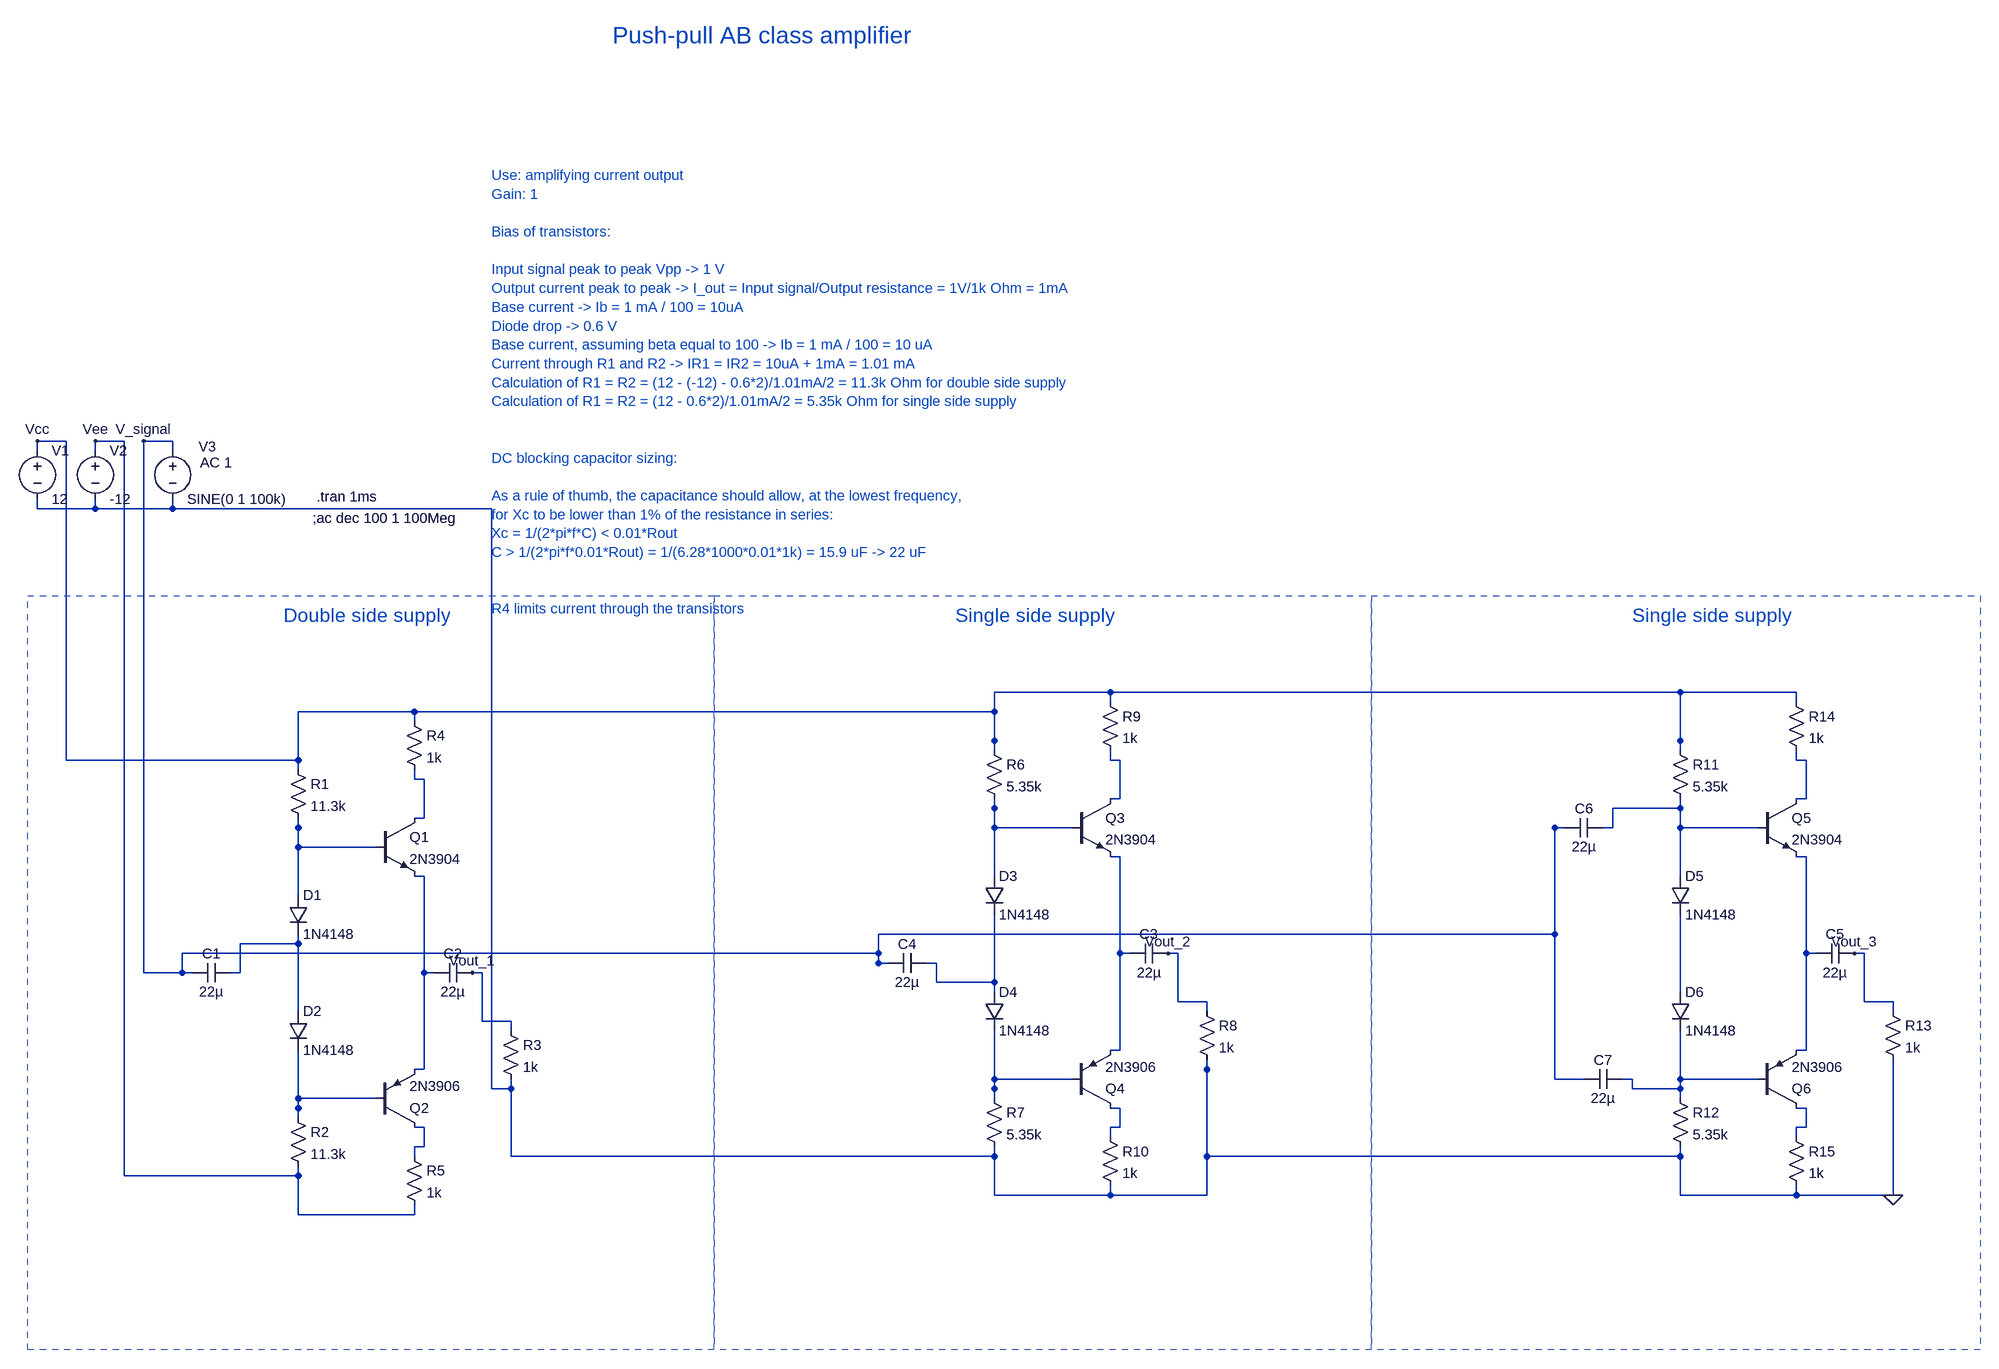
[diagram p0: schematic Push-pull-amplifier-AB-BJT.asc]
Push-pull-amplifier-AB-BJT.asc, the LTspice schematic file:
Version 4.1
SHEET 1 3188 900
WIRE 1424 624 1424 640
WIRE 2368 560 2368 576
WIRE 2720 416 2720 432
WIRE 2560 624 2560 640
WIRE 432 448 432 464
WIRE 1232 560 1232 576
WIRE 1584 416 1584 432
WIRE -352 -512 -352 -496
WIRE -256 -512 -256 -496
WIRE -128 -512 -128 -496
WIRE 1424 640 1232 640
WIRE 1232 640 1232 576
WIRE 1424 640 1584 640
WIRE 1584 640 1584 432
WIRE 1232 576 432 576
WIRE 432 576 432 464
WIRE 1584 432 1584 576
WIRE 1584 576 2368 576
WIRE 2368 576 2368 640
WIRE 2368 640 2560 640
WIRE 2560 640 2720 640
WIRE 2720 640 2720 432
WIRE 432 464 400 464
WIRE 400 464 400 -496
WIRE 400 -496 -128 -496
WIRE -128 -496 -256 -496
WIRE -256 -496 -352 -496
FLAG 2720 640 0
WIRE 1424 -16 1440 -16
WIRE 1424 -96 1424 -80
WIRE 1440 -16 1440 -80
WIRE 1440 -80 1424 -80
WIRE 2560 -16 2576 -16
WIRE 2560 -96 2560 -80
WIRE 2576 -16 2576 -80
WIRE 2576 -80 2560 -80
WIRE 272 16 288 16
WIRE 272 -64 272 -48
WIRE 288 16 288 -48
WIRE 288 -48 272 -48
WIRE 1232 112 1232 96
WIRE 1360 32 1344 32
WIRE 1232 -16 1232 0
WIRE 1232 96 1232 0
WIRE 1232 0 1232 32
WIRE 1232 32 1344 32
WIRE 2240 32 2256 32
WIRE 2368 112 2368 96
WIRE 2496 32 2480 32
WIRE 2368 -16 2368 0
WIRE 2256 32 2256 0
WIRE 2256 0 2368 0
WIRE 2368 0 2368 96
WIRE 2368 0 2368 32
WIRE 2368 32 2480 32
WIRE 80 144 80 128
WIRE 208 64 192 64
WIRE 80 16 80 32
WIRE 80 128 80 32
WIRE 80 32 80 64
WIRE 80 64 192 64
WIRE 1456 240 1440 240
WIRE 1424 80 1440 80
WIRE 1424 400 1440 400
WIRE 1440 240 1440 80
WIRE 1440 240 1440 400
WIRE 2592 240 2576 240
WIRE 2560 80 2576 80
WIRE 2560 400 2576 400
WIRE 2576 240 2576 80
WIRE 2576 240 2576 400
WIRE 1120 256 1136 256
WIRE 1232 176 1232 192
WIRE 1232 304 1232 288
WIRE 1136 256 1136 288
WIRE 1136 288 1232 288
WIRE 1232 288 1232 192
WIRE -32 272 -16 272
WIRE 80 208 80 224
WIRE 80 336 80 320
WIRE -16 272 -16 224
WIRE -16 224 80 224
WIRE 80 224 80 320
WIRE 304 272 288 272
WIRE 272 112 288 112
WIRE 272 432 288 432
WIRE 288 272 288 112
WIRE 288 272 288 432
WIRE 2368 176 2368 192
WIRE 2368 304 2368 288
WIRE 2368 192 2368 288
WIRE 1232 368 1232 384
WIRE 1360 448 1344 448
WIRE 1232 480 1232 464
WIRE 1232 384 1232 464
WIRE 1232 464 1232 448
WIRE 1232 448 1344 448
WIRE 2272 448 2288 448
WIRE 2368 368 2368 384
WIRE 2496 448 2480 448
WIRE 2368 480 2368 464
WIRE 2288 448 2288 464
WIRE 2288 464 2368 464
WIRE 2368 464 2368 384
WIRE 2368 464 2368 448
WIRE 2368 448 2480 448
WIRE 80 400 80 416
WIRE 208 480 192 480
WIRE 80 512 80 496
WIRE 80 416 80 496
WIRE 80 496 80 480
WIRE 80 480 192 480
WIRE 1424 496 1440 496
WIRE 1424 544 1424 528
WIRE 1440 496 1440 528
WIRE 1440 528 1424 528
WIRE 2560 496 2576 496
WIRE 2560 544 2560 528
WIRE 2576 496 2576 528
WIRE 2576 528 2560 528
WIRE 272 528 288 528
WIRE 272 576 272 560
WIRE 288 528 288 560
WIRE 288 560 272 560
WIRE -96 272 -112 272
WIRE 1056 256 1040 256
WIRE 2176 32 2160 32
WIRE 2208 448 2192 448
WIRE -128 -592 -128 -608
WIRE -112 272 -176 272
WIRE -176 272 -176 -608
WIRE -176 -608 -128 -608
WIRE -112 272 -112 240
WIRE -112 240 1040 240
WIRE 1040 240 1040 256
WIRE 1040 256 1040 208
WIRE 1040 208 2160 208
WIRE 2160 208 2160 32
WIRE 2160 32 2160 448
WIRE 2160 448 2192 448
FLAG -176 -608 V_signal
WIRE 80 -64 80 -80
WIRE 2368 -96 2368 -112
WIRE 2560 -176 2560 -192
WIRE 272 -144 272 -160
WIRE 1232 -96 1232 -112
WIRE 1424 -176 1424 -192
WIRE -352 -592 -352 -608
WIRE 80 -80 80 -160
WIRE 80 -160 272 -160
WIRE 80 -80 -304 -80
WIRE -304 -80 -304 -608
WIRE -304 -608 -352 -608
WIRE 272 -160 1232 -160
WIRE 1232 -160 1232 -112
WIRE 1232 -112 1232 -192
WIRE 1232 -192 1424 -192
WIRE 1424 -192 2368 -192
WIRE 2368 -192 2368 -112
WIRE 2368 -112 2368 -192
WIRE 2368 -192 2560 -192
FLAG -352 -608 Vcc
WIRE 80 592 80 608
WIRE 272 656 272 672
WIRE -256 -592 -256 -608
WIRE 80 608 80 672
WIRE 80 672 272 672
WIRE 80 608 -208 608
WIRE -208 608 -208 -608
WIRE -208 -608 -256 -608
FLAG -256 -608 Vee
WIRE 368 272 384 272
WIRE 432 368 432 352
WIRE 384 272 384 352
WIRE 384 352 432 352
FLAG 368 272 Vout_1
WIRE 1520 240 1536 240
WIRE 1584 336 1584 320
WIRE 1536 240 1536 320
WIRE 1536 320 1584 320
FLAG 1520 240 Vout_2
WIRE 2656 240 2672 240
WIRE 2720 336 2720 320
WIRE 2672 240 2672 320
WIRE 2672 320 2720 320
FLAG 2656 240 Vout_3
SYMBOL voltage -352 -608 R0
WINDOW 123 0 0 Left 0
WINDOW 39 0 0 Left 0
SYMATTR InstName V1
SYMATTR Value 12
SYMBOL voltage -256 -608 R0
WINDOW 123 0 0 Left 0
WINDOW 39 0 0 Left 0
SYMATTR InstName V2
SYMATTR Value -12
SYMBOL npn 208 16 R0
SYMATTR InstName Q1
SYMATTR Value 2N3904
SYMBOL pnp 208 528 M180
SYMATTR InstName Q2
SYMATTR Value 2N3906
SYMBOL res 64 -80 R0
SYMATTR InstName R1
SYMATTR Value 11.3k
SYMBOL diode 64 144 R0
SYMATTR InstName D1
SYMATTR Value 1N4148
SYMBOL diode 64 336 R0
SYMATTR InstName D2
SYMATTR Value 1N4148
SYMBOL res 64 496 R0
SYMATTR InstName R2
SYMATTR Value 11.3k
SYMBOL voltage -128 -608 R0
WINDOW 0 43 9 Left 2
WINDOW 123 45 36 Left 2
WINDOW 39 0 0 Left 0
SYMATTR InstName V3
SYMATTR Value SINE(0 1 100k)
SYMATTR Value2 AC 1
SYMBOL res 416 352 R0
SYMATTR InstName R3
SYMATTR Value 1k
SYMBOL cap -32 256 R90
WINDOW 0 0 32 VBottom 2
WINDOW 3 32 32 VTop 2
SYMATTR InstName C1
SYMATTR Value 22µ
SYMBOL cap 368 256 R90
WINDOW 0 0 32 VBottom 2
WINDOW 3 32 32 VTop 2
SYMATTR InstName C2
SYMATTR Value 22µ
SYMBOL res 256 560 R0
SYMATTR InstName R5
SYMATTR Value 1k
SYMBOL npn 1360 -16 R0
SYMATTR InstName Q3
SYMATTR Value 2N3904
SYMBOL pnp 1360 496 M180
SYMATTR InstName Q4
SYMATTR Value 2N3906
SYMBOL res 1216 -112 R0
SYMATTR InstName R6
SYMATTR Value 5.35k
SYMBOL diode 1216 112 R0
SYMATTR InstName D3
SYMATTR Value 1N4148
SYMBOL diode 1216 304 R0
SYMATTR InstName D4
SYMATTR Value 1N4148
SYMBOL res 1216 464 R0
SYMATTR InstName R7
SYMATTR Value 5.35k
SYMBOL res 1568 320 R0
SYMATTR InstName R8
SYMATTR Value 1k
SYMBOL cap 1520 224 R90
WINDOW 0 0 32 VBottom 2
WINDOW 3 32 32 VTop 2
SYMATTR InstName C3
SYMATTR Value 22µ
SYMBOL res 1408 528 R0
SYMATTR InstName R10
SYMATTR Value 1k
SYMBOL cap 1120 240 R90
WINDOW 0 0 32 VBottom 2
WINDOW 3 32 32 VTop 2
SYMATTR InstName C4
SYMATTR Value 22µ
SYMBOL npn 2496 -16 R0
SYMATTR InstName Q5
SYMATTR Value 2N3904
SYMBOL pnp 2496 496 M180
SYMATTR InstName Q6
SYMATTR Value 2N3906
SYMBOL res 2352 -112 R0
SYMATTR InstName R11
SYMATTR Value 5.35k
SYMBOL diode 2352 112 R0
SYMATTR InstName D5
SYMATTR Value 1N4148
SYMBOL diode 2352 304 R0
SYMATTR InstName D6
SYMATTR Value 1N4148
SYMBOL res 2352 464 R0
SYMATTR InstName R12
SYMATTR Value 5.35k
SYMBOL res 2704 320 R0
SYMATTR InstName R13
SYMATTR Value 1k
SYMBOL cap 2656 224 R90
WINDOW 0 0 32 VBottom 2
WINDOW 3 32 32 VTop 2
SYMATTR InstName C5
SYMATTR Value 22µ
SYMBOL res 2544 -192 R0
SYMATTR InstName R14
SYMATTR Value 1k
SYMBOL res 2544 528 R0
SYMATTR InstName R15
SYMATTR Value 1k
SYMBOL cap 2240 16 R90
WINDOW 0 0 32 VBottom 2
WINDOW 3 32 32 VTop 2
SYMATTR InstName C6
SYMATTR Value 22µ
SYMBOL cap 2272 432 R90
WINDOW 0 0 32 VBottom 2
WINDOW 3 32 32 VTop 2
SYMATTR InstName C7
SYMATTR Value 22µ
SYMBOL res 256 -160 R0
SYMATTR InstName R4
SYMATTR Value 1k
SYMBOL res 1408 -192 R0
SYMATTR InstName R9
SYMATTR Value 1k
TEXT 110 -516 Left 2 !.tran 1ms
TEXT 400 -1048 Left 2 ;Use: amplifying current output\nGain: 1\n \nBias of transistors:\n \nInput signal peak to peak Vpp -> 1 V\nOutput current peak to peak -> I_out = Input signal/Output resistance = 1V/1k Ohm = 1mA\nBase current -> Ib = 1 mA / 100 = 10uA\nDiode drop -> 0.6 V\nBase current, assuming beta equal to 100 -> Ib = 1 mA / 100 = 10 uA\nCurrent through R1 and R2 -> IR1 = IR2 = 10uA + 1mA = 1.01 mA\nCalculation of R1 = R2 = (12 - (-12) - 0.6*2)/1.01mA/2 = 11.3k Ohm for double side supply\nCalculation of R1 = R2 = (12 - 0.6*2)/1.01mA/2 = 5.35k Ohm for single side supply\n \n \nDC blocking capacitor sizing:\n \nAs a rule of thumb, the capacitance should allow, at the lowest frequency, \nfor Xc to be lower than 1% of the resistance in series:\nXc = 1/(2*pi*f*C) < 0.01*Rout \nC > 1/(2*pi*f*0.01*Rout) = 1/(6.28*1000*0.01*1k) = 15.9 uF -> 22 uF\n \n\nR4 limits current through the transistors
TEXT 104 -480 Left 2 !;ac dec 100 1 100Meg
TEXT 56 -320 Left 3 ;Double side supply
TEXT 1168 -320 Left 3 ;Single side supply
TEXT 2288 -320 Left 3 ;Single side supply
TEXT 600 -1280 Left 4 ;Push-pull AB class amplifier
RECTANGLE Normal 768 896 -368 -352 2
RECTANGLE Normal 1856 896 768 -352 2
RECTANGLE Normal 2864 896 1856 -352 2

The netlist it stands for:
* Push-pull-amplifier-AB-BJT.asc
V1 Vcc 0 12
V2 Vee 0 -12
Q1 N003 N006 N011 0 2N3904
Q2 N018 N015 N011 0 2N3906
R1 Vcc N006 11.3k
D1 N006 N010 1N4148
D2 N010 N015 1N4148
R2 N015 Vee 11.3k
V3 V_signal 0 SINE(0 1 100k) AC 1
R3 Vout_1 0 1k
C1 N010 V_signal 22µ
C2 Vout_1 N011 22µ
R5 N018 Vee 1k
Q3 N001 N004 N007 0 2N3904
Q4 N016 N013 N007 0 2N3906
R6 Vcc N004 5.35k
D3 N004 N009 1N4148
D4 N009 N013 1N4148
R7 N013 0 5.35k
R8 Vout_2 0 1k
C3 Vout_2 N007 22µ
R10 N016 0 1k
C4 N009 V_signal 22µ
Q5 N002 N005 N008 0 2N3904
Q6 N017 N014 N008 0 2N3906
R11 Vcc N005 5.35k
D5 N005 N012 1N4148
D6 N012 N014 1N4148
R12 N014 0 5.35k
R13 Vout_3 0 1k
C5 Vout_3 N008 22µ
R14 Vcc N002 1k
R15 N017 0 1k
C6 N005 V_signal 22µ
C7 N014 V_signal 22µ
R4 Vcc N003 1k
R9 Vcc N001 1k
.model D D
.lib standard.dio
.model NPN NPN
.model PNP PNP
.lib standard.bjt
.tran 1ms
* Use: amplifying current output
* Gain: 1
* Bias of transistors:
* Input signal peak to peak Vpp -> 1 V
* Output current peak to peak -> I_out = Input signal/Output resistance = 1V/1k Ohm = 1mA
* Base current -> Ib = 1 mA / 100 = 10uA
* Diode drop -> 0.6 V
* Base current, assuming beta equal to 100 -> Ib = 1 mA / 100 = 10 uA
* Current through R1 and R2 -> IR1 = IR2 = 10uA + 1mA = 1.01 mA
* Calculation of R1 = R2 = (12 - (-12) - 0.6*2)/1.01mA/2 = 11.3k Ohm for double side supply
* Calculation of R1 = R2 = (12 - 0.6*2)/1.01mA/2 = 5.35k Ohm for single side supply
* DC blocking capacitor sizing:
* As a rule of thumb, the capacitance should allow, at the lowest frequency,
* for Xc to be lower than 1% of the resistance in series:
* Xc = 1/(2*pi*f*C) < 0.01*Rout
* C > 1/(2*pi*f*0.01*Rout) = 1/(6.28*1000*0.01*1k) = 15.9 uF -> 22 uF
* R4 limits current through the transistors
;ac dec 100 1 100Meg
* Double side supply
* Single side supply
* Single side supply
* Push-pull AB class amplifier
.backanno
.end